# Altium schematic sheet Bitcoin Wallet.SchDoc: COIN WALLET
size A4; Date: 2018.04.01; Revision: Beta 1.0
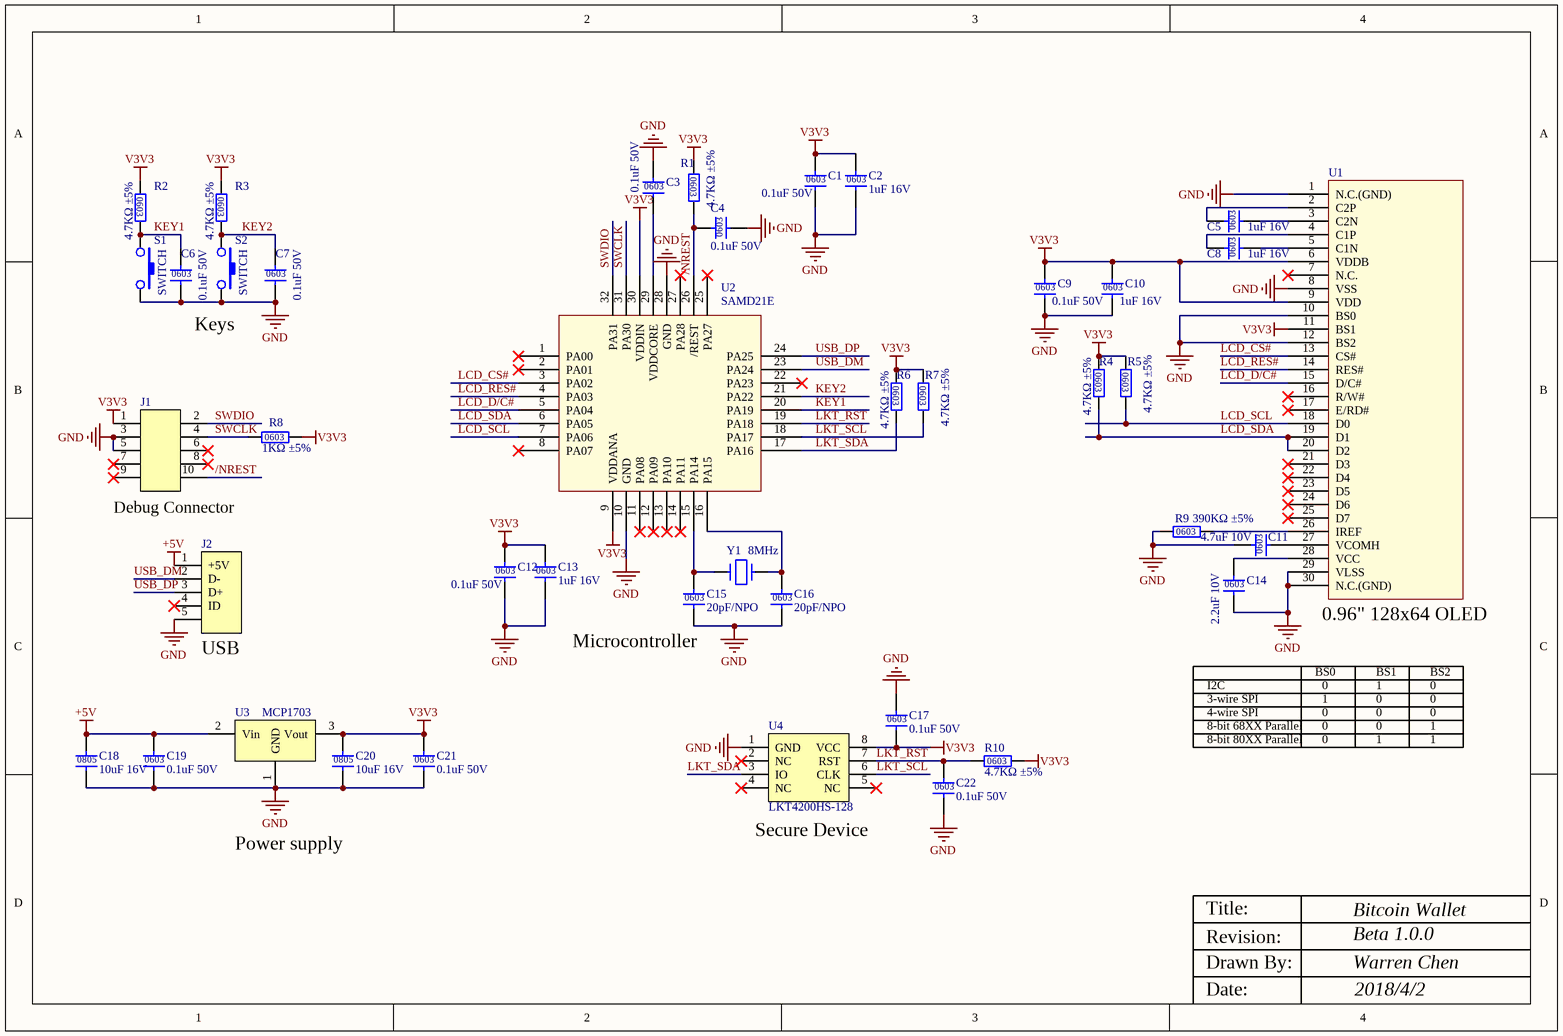
[diagram p0: Bitcoin Wallet.SchDoc]

## Parts
C1  0.1uF 50V  [C-0603]
C2  1uF 16V  [C-0603]
C3  0.1uF 50V  [C-0603]
C4  0.1uF 50V  [C-0603]
C5  1uF 16V  [C-0603]
C6  0.1uF 50V  [C-0603]
C7  0.1uF 50V  [C-0603]
C8  1uF 16V  [C-0603]
C9  0.1uF 50V  [C-0603]
C10  1uF 16V  [C-0603]
C11  4.7uF 10V  [C-0603]
C12  0.1uF 50V  [C-0603]
C13  1uF 16V  [C-0603]
C14  2.2uF 10V  [C-0603]
C15  20pF/NPO  [C-0603]
C16  20pF/NPO  [C-0603]
C17  0.1uF 50V  [C-0603]
C18  10uF 16V  [C-0805]
C19  0.1uF 50V  [C-0603]
C20  10uF 16V  [C-0805]
C21  0.1uF 50V  [C-0603]
C22  0.1uF 50V  [C-0603]
J1  Debug Connector
J2  USB
R1  4.7KΩ ±5%  [R-0603]
R2  4.7KΩ ±5%  [R-0603]
R3  4.7KΩ ±5%  [R-0603]
R4  4.7KΩ ±5%  [R-0603]
R5  4.7KΩ ±5%  [R-0603]
R6  4.7KΩ ±5%  [R-0603]
R7  4.7KΩ ±5%  [R-0603]
R8  1KΩ ±5%  [R-0603]
R9  390KΩ ±5%  [R-0603]
R10  4.7KΩ ±5%  [R-0603]
S1  SWITCH  [SW4-6X6-1]
S2  SWITCH  [SW4-6X6-1]
U1  0.96" 128x64 OLED
U2  SAMD21E
U3  MCP1703  [IC-SOT-89]
U4  LKT4200HS-128
Y1  8MHz  [CRYSTAL2]

## Nets
+5V: C18.1 C19.1 J2.1(+5V) U3.2(Vin)
GND: C1.2 C2.2 C3.1 C4.2 C6.2 C7.2 C9.2 C10.2 C11.1 C12.2 C13.2 C14.2 C15.2 C16.2 C17.1 C18.2 C19.2 C20.2 C21.2 C22.2 J1.3 J1.5 J2.5(GND) R9.1 S1.1 S2.1 U1.1(N.C.(GND)) U1.8(VSS) U1.10(BS0) U1.12(BS2) U1.29(VLSS) U1.30(N.C.(GND)) U2.10(GND) U2.28(GND) U3.1(GND) U4.1(GND)
V3V3: C1.1 C2.1 C9.1 C10.1 C12.1 C13.1 C17.2 C20.1 C21.1 J1.1 R1.1 R2.1 R3.1 R4.1 R5.1 R6.1 R7.1 R8.2 R10.2 U1.6(VDDB) U1.9(VDD) U1.11(BS1) U2.9(VDDANA) U2.30(VDDIN) U3.3(Vout) U4.8(VCC)
/NREST: C4.1 R1.2 U2.26(/REST)
KEY1: C6.1 R2.2 S1.2 U2.20(PA19)
KEY2: C7.1 R3.2 S2.2 U2.21(PA22)
LCD_CS#: U1.13(CS#) U2.3(PA02)
LCD_D/C#: U1.15(D/C#) U2.5(PA04)
LCD_RES#: U1.14(RES#) U2.4(PA03)
LCD_SCL: R5.2 U1.18(D0) U2.7(PA06)
LCD_SDA: R4.2 U1.19(D1) U1.20(D2) U2.6(PA05)
LKT_RST: C22.1 R10.1 U2.19(PA18) U4.7(RST)
LKT_SCL: R7.2 U2.18(PA17) U4.6(CLK)
LKT_SDA: R6.2 U2.17(PA16) U4.3(IO)
SWCLK: J1.4 R8.1 U2.31(PA30)
SWDIO: J1.2 U2.32(PA31)
USB_DM: J2.2(D-) U2.23(PA24)
USB_DP: J2.3(D+) U2.24(PA25)
NetC3_2: C3.2 U2.29(VDDCORE)
NetC5_1: C5.1 U1.2(C2P)
NetC5_2: C5.2 U1.3(C2N)
NetC8_1: C8.1 U1.4(C1P)
NetC8_2: C8.2 U1.5(C1N)
NetC11_2: C11.2 U1.27(VCOMH)
NetC14_1: C14.1 U1.28(VCC)
NetC15_1: C15.1 U2.15(PA14) Y1.3
NetC16_1: C16.1 U2.16(PA15) Y1.1
NetR9_2: R9.2 U1.26(IREF)

Not connected (* = marked no-connect by the designer): J1 6* 7* 8* 9* 10; J2 4(ID)*; U1 7(N.C.)* 16(R/W#)* 17(E/RD#)* 21(D3)* 22(D4)* 23(D5)* 24(D6)* 25(D7)*; U2 1(PA00)* 2(PA01)* 8(PA07)* 11(PA08)* 12(PA09)* 13(PA10)* 14(PA11)* 22(PA23)* 25(PA27)* 27(PA28)*; U4 2(NC)* 4(NC)* 5(NC)*

## Notes on the sheet
- Keys
- (near C15) Microcontroller
- I2C
- 3-wire SPI
- 4-wire SPI
- BS0
- 0
- 1
- BS1
- BS2
- 8-bit 68XX Parallel
- 8-bit 80XX Parallel
- Power supply
- (near U4) Secure Device
- Title:
- Bitcoin Wallet
- Revision:
- Drawn By:
- Beta 1.0.0
- Warren Chen
- Date:
- 2018/4/2
- (in symbol C-0.1uF 50V 0603) 0603
- (in symbol C-1uF 16V 0603) 0603
- (in symbol C-2.2uF 10V 0603) 0603
- (in symbol C-4.7uF 10V 0603) 0603
- (in symbol C-10uF 16V 0805) 0805
- (in symbol C-20pF 50V 0603) 0603
- (in symbol R-1K 0603 5%) 0603
- (in symbol R-4K7 0603 5%) 0603
- (in symbol R-390K 0603 5%) 0603

## Library data of the parts
C1 C3 C4 C6 C7 C9 C12 C17 C19 C21 C22 = C-0.1uF 50V 0603: 贴片电容 0.1uF 50V ±10% -55~+125℃ 0603 X7R CL10B104KB8NNNC; LH: C01-100N26-100; U_TABLE: U_C
C2 C5 C8 C10 C13 = C-1uF 16V 0603: 贴片电容 1uF 16V ±10% -55~+125℃ 0603 X7R; LH: C01-1U0016-102; U_TABLE: U_C
C11 = C-4.7uF 10V 0603: 贴片电容 4.7uF 10V ±10% 0603 X5R; LH: C01-4U7026-400; U_TABLE: U_C
C14 = C-2.2uF 10V 0603: 贴片电容 2.2uF 10V ±10% 0603 X5R; LH: C01-2U2026-400; U_TABLE: U_C
C15 C16 = C-20pF 50V 0603: 贴片电容 20pF 50V ±5% -55~+125℃ 0603 NPO; LH: C01-20P025-100; U_TABLE: U_C
C18 C20 = C-10uF 16V 0805: 贴片电容 10uF 16V ±10% -55~+125℃ 0805 X5R; LH: C01-10U016-200 AB
J1 = CON2*5
R1-R7 R10 = R-4K7 0603 5%: 贴片电阻 4.7KΩ 1/10W ±5% ±200ppm 0603; LH: R01-4K7026-100; U_TABLE: U_R
R8 = R-1K 0603 5%: 贴片电阻 1KΩ 1/10W ±5% ±200ppm 0603; LH: R01-1K0026-100; U_TABLE: U_R
R9 = R-390K 0603 5%: 贴片电阻 390KΩ 1/10W ±5% ±200ppm 0603; LH: R01-390K26-100; U_TABLE: U_R
S1 S2 = SW_PB6.2*6.2_5: 开关（轻触）; LH: Y07-031-0000; U_TABLE: U_SW; U_ITEM_ID（item_id）: Part00058227; U_OBJECT_NAME（物料名称）: CL710N99-6循显插件轻触开关; U_CL2_ITEMM_00（物料编码）: 20110000000004; U_CL2_ITEMR_00（物料描述）: 插件轻触开关 TS-1070 6.2*6.2*5mm 高; U_1002（指定生产商）: 浙江开拓数码科技有限公司; U_200002（型号）: TS-1070; U_200140（总高(mm)）: 5.00000000000000; U_200141（柄长(mm)）: 0.000000000000000; U_200084（尺寸(mm)）: 6.2*6.2
U1 = Component_1
U3 = U-HT7533-1: HT7533-1 工业级 SOT-89 3.3V 100mA; LH: I03-007533-600; U_TABLE: U_IC
Y1 = CRYSTAL_18.432M: 晶振; LH: Y01-18M434-701; U_TABLE: U_Y; U_ITEM_ID（item_id）: Part00052574; U_OBJECT_NAME（物料名称）: 无源晶振; U_CL2_ITEMM_00（物料编码）: 20100000000010; U_CL2_ITEMR_00（物料描述）: 晶振 5YAA12000202TFA0C3 12MHz ±20PPM 20PF 工业级-55~+125℃ SMD 3.2*2.5 4PAD 港中兴; U_1002（指定生产商）: 港中兴; U_200002（型号）: 5YAA12000202TFA0C3; U_200003（温度范围）: -55~+125℃; U_200004（封装）: 3225; U_200058（频率）: 12MHz; U_200087（频偏）: ±20PPM; U_200088（负载电容）: 20PF